# Altium schematic sheet Sheet1.SchDoc
size 762 x 381 mm
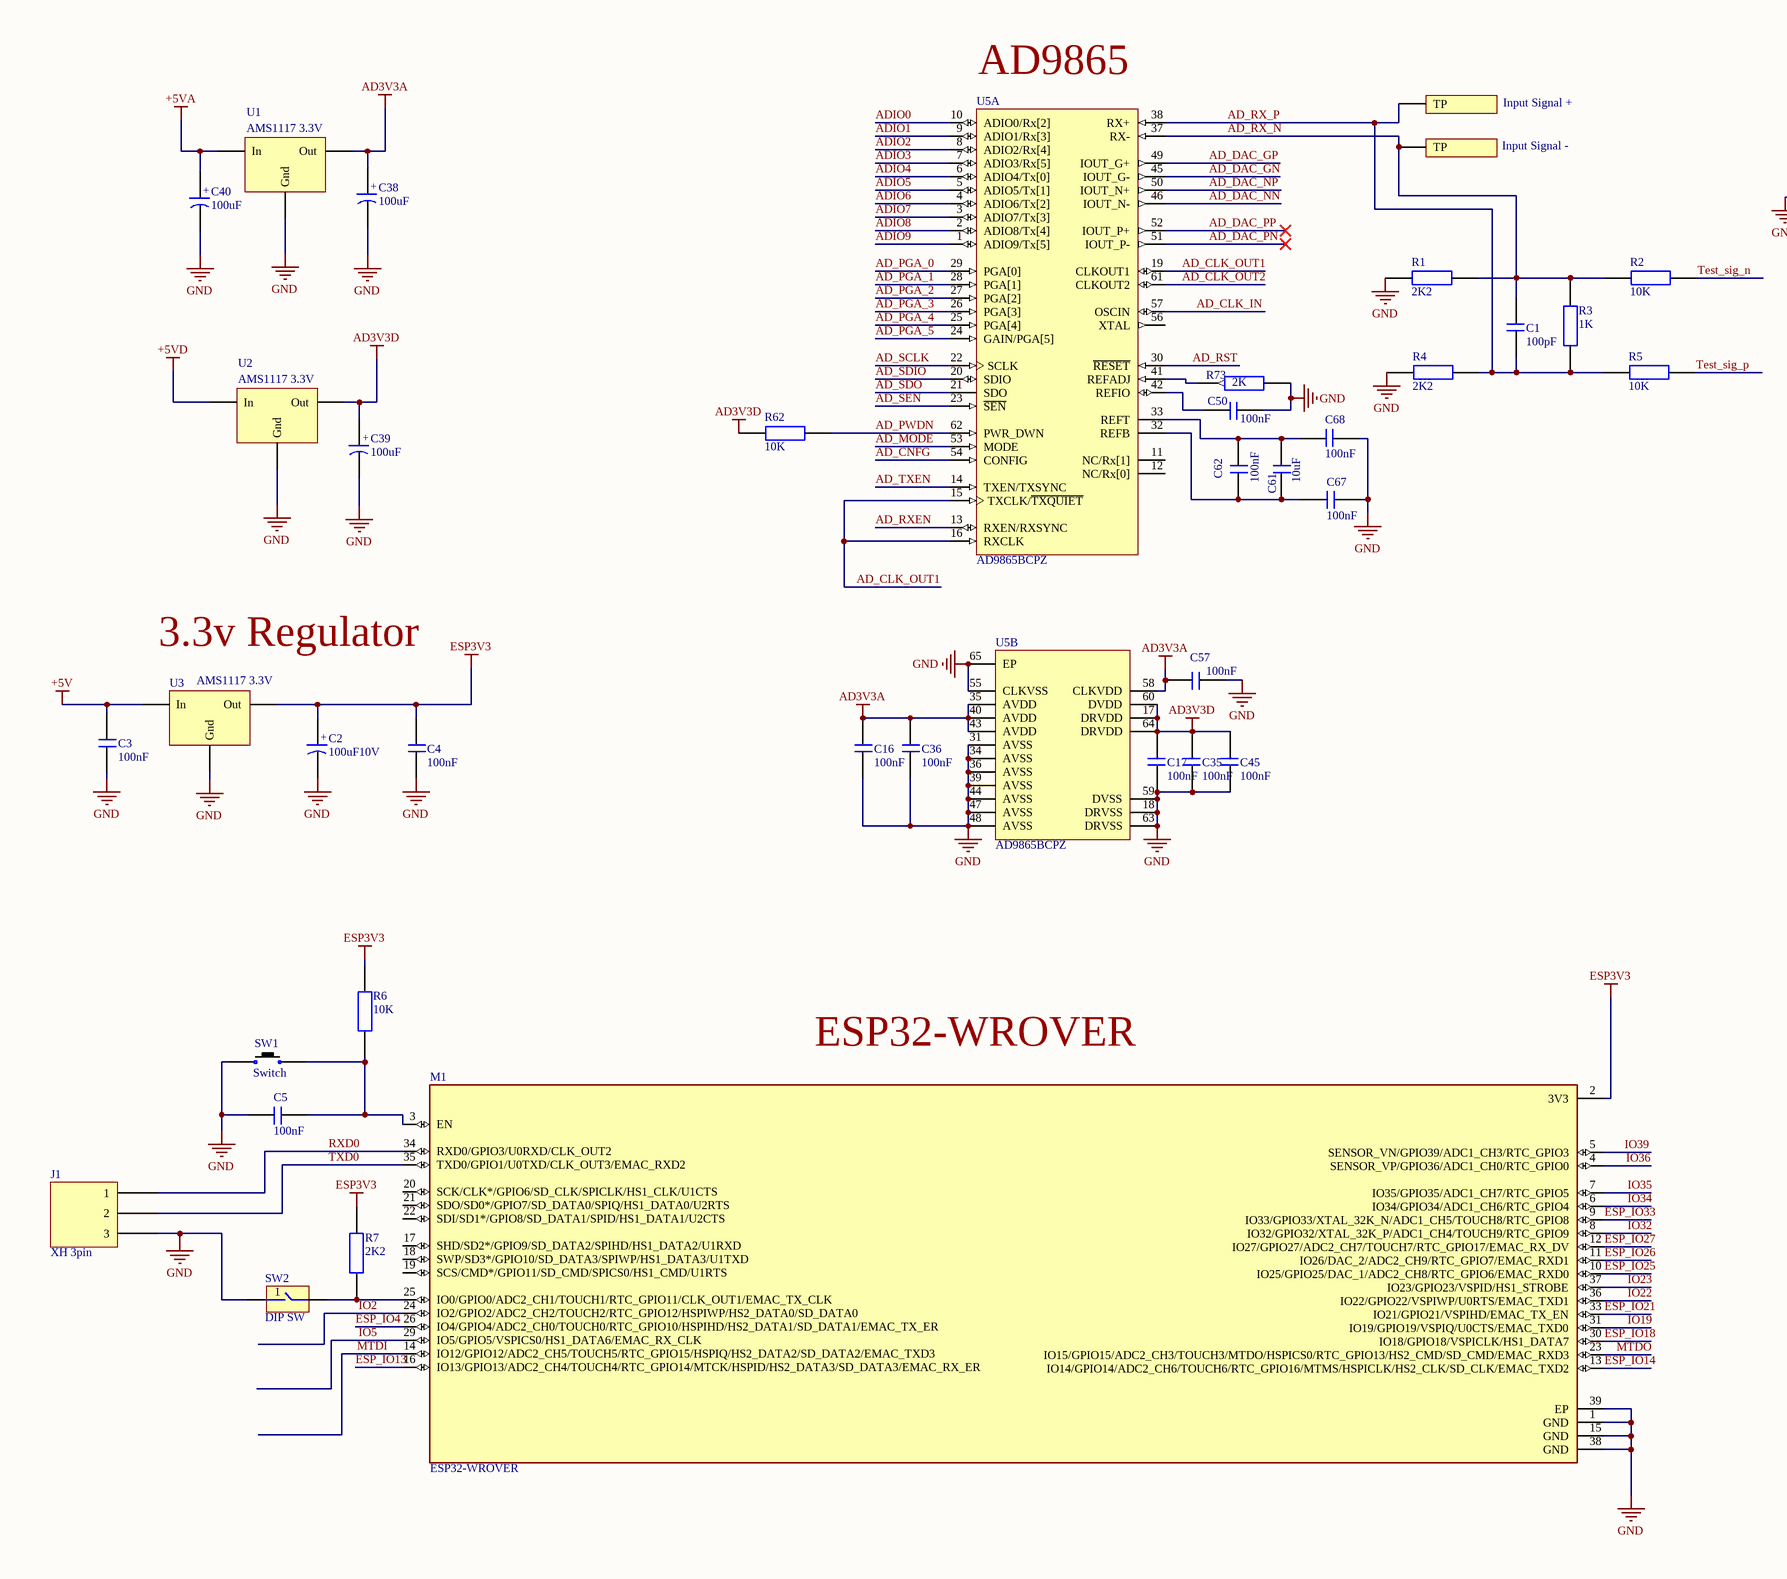
[diagram p0: Sheet1.SchDoc, left]
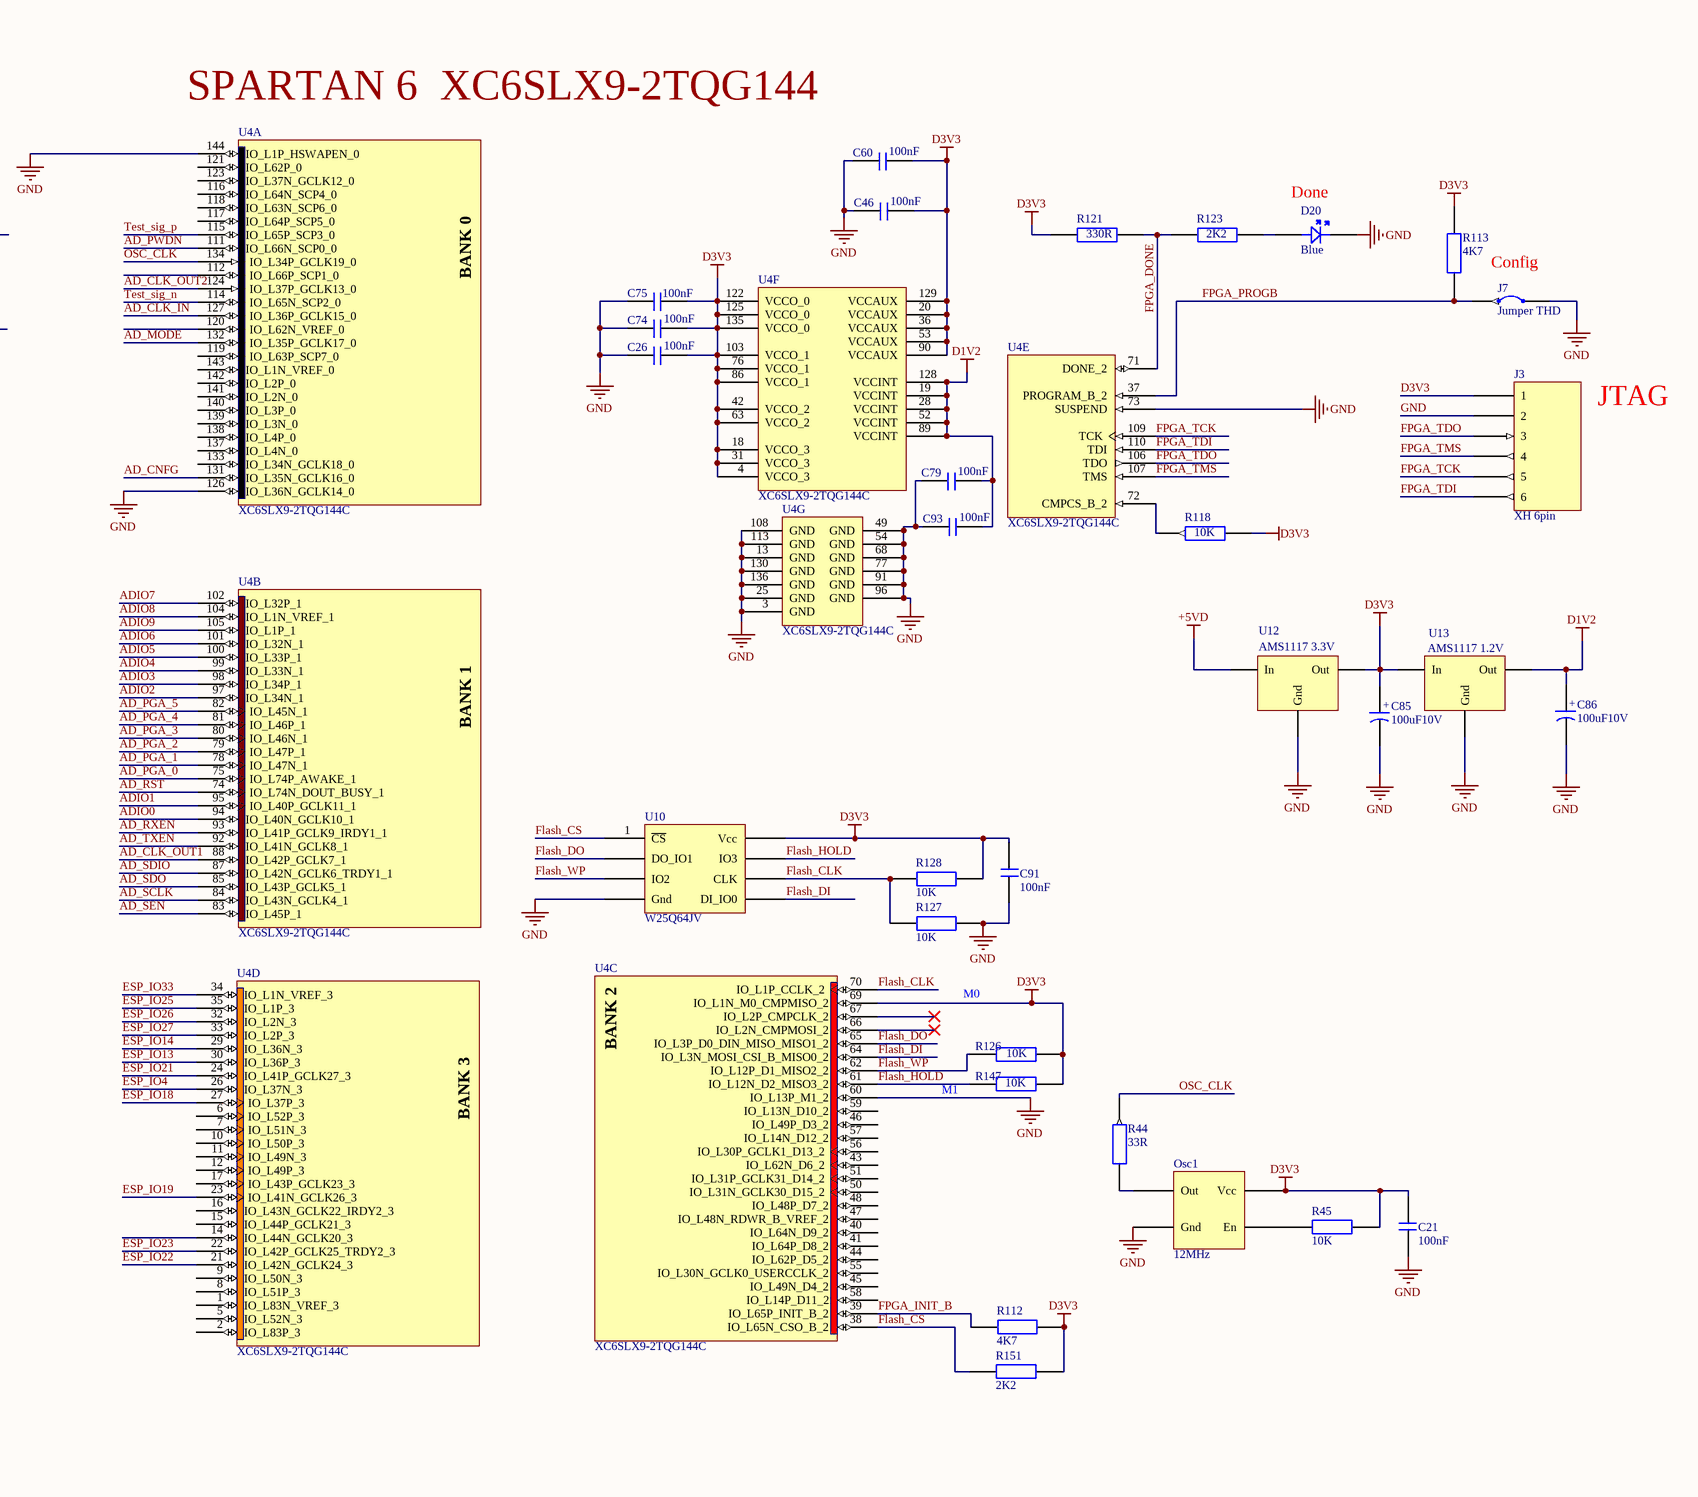
[diagram p1: Sheet1.SchDoc, right]

## Parts
C1  100pF  [CAP_0805]
C2  100uF10V  [Cap_Tan_Size_B]
C3  100nF  [CAP_0805]
C4  100nF  [CAP_0805]
C5  100nF  [CAP_0805]
C16  100nF  [CAP_0805]
C17  100nF  [CAP_0805]
C21  100nF  [CAP_0805]
C26  100nF  [CAP_0805]
C35  100nF  [CAP_0805]
C36  100nF  [CAP_0805]
C38  100uF  [Cap_Tan_Size_B]
C39  100uF  [Cap_Tan_Size_B]
C40  100uF  [Cap_Tan_Size_B]
C45  100nF  [CAP_0805]
C46  100nF  [CAP_0805]
C50  100nF  [CAP_0805]
C57  100nF  [CAP_0805]
C60  100nF  [CAP_0805]
C61  10uF  [CAP_0805]
C62  100nF  [CAP_0805]
C67  100nF  [CAP_0805]
C68  100nF  [CAP_0805]
C74  100nF  [CAP_0805]
C75  100nF  [CAP_0805]
C79  100nF  [CAP_0805]
C85  100uF10V  [Cap_Tan_Size_B]
C86  100uF10V  [Cap_Tan_Size_B]
C91  100nF  [CAP_0805]
C93  100nF  [CAP_0805]
D20  Blue  [LED_0805_Blue]
J1  XH 3pin  [XH-3pin]
J3  XH 6pin  [XH-6pin]
J7  Jumper THD  [Jumper_2pin]
M1  ESP32-WROVER  [ESP32-WROVER]
Osc1  12MHz  [Osc_SMD_5x7]
R1  2K2  [RES_0805]
R2  10K  [RES_0805]
R3  1K  [RES_0805]
R4  2K2  [RES_0805]
R5  10K  [RES_0805]
R6  10K  [RES_0805]
R7  2K2  [RES_0805]
R44  33R  [RES_0805]
R45  10K  [RES_0805]
R62  10K  [RES_0805]
R73  2K  [RES_0805]
R112  4K7  [RES_0805]
R113  4K7  [RES_0805]
R118  10K  [RES_0805]
R121  330R  [RES_0805]
R123  2K2  [RES_0805]
R126  10K  [RES_0805]
R127  10K  [RES_0805]
R128  10K  [RES_0805]
R147  10K  [RES_0805]
R151  2K2  [RES_0805]
SW1  Switch  [Tact_SW_SMD]
SW2  DIP SW  [DIP_SW_1key]
TP1  Input Signal +  [TP]  (no BOM)
TP2  Input Signal -  [TP]  (no BOM)
U1  AMS1117 3.3V  [AMS1117-SOT223]
U2  AMS1117 3.3V  [AMS1117-SOT223]
U3  AMS1117 3.3V  [AMS1117-SOT223]
U4  XC6SLX9-2TQG144C  [XILINX-TQG144_M]  (parts A,B,C,D,E,F,G of 7)
U5  AD9865BCPZ  [LFCSP_64Lead]  (parts A,B of 2)
U10  W25Q64JV  [W25Q64]
U12  AMS1117 3.3V  [AMS1117-SOT223]
U13  AMS1117 1.2V  [AMS1117-SOT223]

## Nets
+5V: C3.2 U3.1(In)
+5VA: C40.+ U1.1(In)
+5VD: U2.1(In) U12.1(In)
AD3V3A: C16.2 C36.2 C38.+ C57.1 U1.3(Out) U5.35(AVDD) U5.40(AVDD) U5.43(AVDD) U5.58(CLKVDD)
AD3V3D: C17.1 C35.1 C39.+ C45.1 R62.1 U2.3(Out) U5.17(DRVDD) U5.60(DVDD) U5.64(DRVDD)
D1V2: C79.2 C86.+ C93.2 U4.19(VCCINT) U4.28(VCCINT) U4.52(VCCINT) U4.89(VCCINT) U4.128(VCCINT) U13.3(Out)
D3V3: C21.1 C26.2 C46.2 C60.2 C74.2 C75.2 C85.+ C91.2 J3.1 Osc1.1(Vcc) R45.2 R112.2 R113.2 R118.2 R121.1 R126.2 R128.2 R147.2 R151.2 U4.4(VCCO_3) U4.18(VCCO_3) U4.20(VCCAUX) U4.31(VCCO_3) U4.36(VCCAUX) U4.42(VCCO_2) U4.53(VCCAUX) U4.63(VCCO_2) U4.69(IO_L1N_M0_CMPMISO_2) U4.76(VCCO_1) U4.86(VCCO_1) U4.90(VCCAUX) U4.103(VCCO_1) U4.122(VCCO_0) U4.125(VCCO_0) U4.129(VCCAUX) U4.135(VCCO_0) U10.8(Vcc) U12.3(Out) U13.1(In)
ESP3V3: C2.+ C4.2 M1.2(3V3) R6.2 R7.2 U3.3(Out)
GND: C2.- C3.1 C4.1 C5.1 C16.1 C17.2 C21.2 C26.1 C35.2 C36.1 C38.- C39.- C40.- C45.2 C46.1 C50.2 C57.2 C60.1 C67.2 C68.1 C74.1 C75.1 C79.1 C85.- C86.- C91.1 C93.1 D20.2 J1.3 J3.2 J7.1 M1.1(GND) M1.15(GND) M1.38(GND) M1.39(EP) Osc1.4(Gnd) R1.2 R4.2 R73.2 R127.1 SW1.2 SW2.1 U1.2(Gnd) U2.2(Gnd) U3.2(Gnd) U4.3(GND) U4.13(GND) U4.25(GND) U4.49(GND) U4.54(GND) U4.60(IO_L13P_M1_2) U4.68(GND) U4.73(SUSPEND) U4.77(GND) U4.91(GND) U4.96(GND) U4.108(GND) U4.113(GND) U4.126(IO_L36N_GCLK14_0) U4.130(GND) U4.136(GND) U4.144(IO_L1P_HSWAPEN_0) U5.18(DRVSS) U5.31(AVSS) U5.34(AVSS) U5.36(AVSS) U5.39(AVSS) U5.44(AVSS) U5.47(AVSS) U5.48(AVSS) U5.55(CLKVSS) U5.59(DVSS) U5.63(DRVSS) U5.65(EP) U10.4(Gnd) U12.2(Gnd) U13.2(Gnd)
AD_CLK_IN: U4.127(IO_L36P_GCLK15_0) U5.57(OSCIN)
AD_CLK_OUT1: U4.88(IO_L42P_GCLK7_1) U5.15(TXCLK/~{TXQUIET}) U5.16(RXCLK) U5.19(CLKOUT1)
AD_CLK_OUT2: U4.124(IO_L37P_GCLK13_0) U5.61(CLKOUT2)
AD_CNFG: U4.131(IO_L35N_GCLK16_0) U5.54(CONFIG)
AD_DAC_GN: U5.45(IOUT_G-)
AD_DAC_GP: U5.49(IOUT_G+)
AD_DAC_NN: U5.46(IOUT_N-)
AD_DAC_NP: U5.50(IOUT_N+)
AD_DAC_PN: U5.51(IOUT_P-)
AD_DAC_PP: U5.52(IOUT_P+)
AD_MODE: U4.132(IO_L35P_GCLK17_0) U5.53(MODE)
AD_PGA_0: U4.75(IO_L74P_AWAKE_1) U5.29(PGA[0])
AD_PGA_1: U4.78(IO_L47N_1) U5.28(PGA[1])
AD_PGA_2: U4.79(IO_L47P_1) U5.27(PGA[2])
AD_PGA_3: U4.80(IO_L46N_1) U5.26(PGA[3])
AD_PGA_4: U4.81(IO_L46P_1) U5.25(PGA[4])
AD_PGA_5: U4.82(IO_L45N_1) U5.24(GAIN/PGA[5])
AD_PWDN: R62.2 U4.111(IO_L66N_SCP0_0) U5.62(PWR_DWN)
AD_RST: U4.74(IO_L74N_DOUT_BUSY_1) U5.30(~{RESET})
AD_RX_N: C1.1 R1.1 R2.2 R3.1 TP2.1(TP) U5.37(RX-)
AD_RX_P: C1.2 R3.2 R4.1 R5.2 TP1.1(TP) U5.38(RX+)
AD_RXEN: U4.93(IO_L41P_GCLK9_IRDY1_1) U5.13(RXEN/RXSYNC)
AD_SCLK: U4.84(IO_L43N_GCLK4_1) U5.22(SCLK)
AD_SDIO: U4.87(IO_L42N_GCLK6_TRDY1_1) U5.20(SDIO)
AD_SDO: U4.85(IO_L43P_GCLK5_1) U5.21(SDO)
AD_SEN: U4.83(IO_L45P_1) U5.23(~{SEN})
AD_TXEN: U4.92(IO_L41N_GCLK8_1) U5.14(TXEN/TXSYNC)
ADIO0: U4.94(IO_L40N_GCLK10_1) U5.10(ADIO0/Rx[2])
ADIO1: U4.95(IO_L40P_GCLK11_1) U5.9(ADIO1/Rx[3])
ADIO2: U4.97(IO_L34N_1) U5.8(ADIO2/Rx[4])
ADIO3: U4.98(IO_L34P_1) U5.7(ADIO3/Rx[5])
ADIO4: U4.99(IO_L33N_1) U5.6(ADIO4/Tx[0])
ADIO5: U4.100(IO_L33P_1) U5.5(ADIO5/Tx[1])
ADIO6: U4.101(IO_L32N_1) U5.4(ADIO6/Tx[2])
ADIO7: U4.102(IO_L32P_1) U5.3(ADIO7/Tx[3])
ADIO8: U4.104(IO_L1N_VREF_1) U5.2(ADIO8/Tx[4])
ADIO9: U4.105(IO_L1P_1) U5.1(ADIO9/Tx[5])
ESP_IO4: M1.26(IO4/GPIO4/ADC2_CH0/TOUCH0/RTC_GPIO10/HSPIHD/HS2_DATA1/SD_DATA1/EMAC_TX_ER) U4.26(IO_L37N_3)
ESP_IO13: M1.16(IO13/GPIO13/ADC2_CH4/TOUCH4/RTC_GPIO14/MTCK/HSPID/HS2_DATA3/SD_DATA3/EMAC_RX_ER) U4.30(IO_L36P_3)
ESP_IO14: M1.13(IO14/GPIO14/ADC2_CH6/TOUCH6/RTC_GPIO16/MTMS/HSPICLK/HS2_CLK/SD_CLK/EMAC_TXD2) U4.29(IO_L36N_3)
ESP_IO18: M1.30(IO18/GPIO18/VSPICLK/HS1_DATA7) U4.27(IO_L37P_3)
ESP_IO19: U4.23(IO_L41N_GCLK26_3)
ESP_IO21: M1.33(IO21/GPIO21/VSPIHD/EMAC_TX_EN) U4.24(IO_L41P_GCLK27_3)
ESP_IO22: U4.21(IO_L42N_GCLK24_3)
ESP_IO23: U4.22(IO_L42P_GCLK25_TRDY2_3)
ESP_IO25: M1.10(IO25/GPIO25/DAC_1/ADC2_CH8/RTC_GPIO6/EMAC_RXD0) U4.35(IO_L1P_3)
ESP_IO26: M1.11(IO26/DAC_2/ADC2_CH9/RTC_GPIO7/EMAC_RXD1) U4.32(IO_L2N_3)
ESP_IO27: M1.12(IO27/GPIO27/ADC2_CH7/TOUCH7/RTC_GPIO17/EMAC_RX_DV) U4.33(IO_L2P_3)
ESP_IO33: M1.9(IO33/GPIO33/XTAL_32K_N/ADC1_CH5/TOUCH8/RTC_GPIO8) U4.34(IO_L1N_VREF_3)
Flash_CLK: R127.2 R128.1 U4.70(IO_L1P_CCLK_2) U10.6(CLK)
Flash_CS: R151.1 U4.38(IO_L65N_CSO_B_2) U10.1(~{CS})
Flash_DI: U4.64(IO_L3N_MOSI_CSI_B_MISO0_2) U10.5(DI_IO0)
Flash_DO: U4.65(IO_L3P_D0_DIN_MISO_MISO1_2) U10.2(DO_IO1)
Flash_HOLD: R147.1 U4.61(IO_L12N_D2_MISO3_2) U10.7(IO3)
Flash_WP: R126.1 U4.62(IO_L12P_D1_MISO2_2) U10.3(IO2)
FPGA_DONE: R121.2 R123.1 U4.71(DONE_2)
FPGA_INIT_B: R112.1 U4.39(IO_L65P_INIT_B_2)
FPGA_PROGB: J7.2 R113.1 U4.37(PROGRAM_B_2)
FPGA_TCK: J3.5 U4.109(TCK)
FPGA_TDI: J3.6 U4.110(TDI)
FPGA_TDO: J3.3 U4.106(TDO)
FPGA_TMS: J3.4 U4.107(TMS)
IO2: M1.24(IO2/GPIO2/ADC2_CH2/TOUCH2/RTC_GPIO12/HSPIWP/HS2_DATA0/SD_DATA0)
IO5: M1.29(IO5/GPIO5/VSPICS0/HS1_DATA6/EMAC_RX_CLK)
IO19: M1.31(IO19/GPIO19/VSPIQ/U0CTS/EMAC_TXD0)
IO22: M1.36(IO22/GPIO22/VSPIWP/U0RTS/EMAC_TXD1)
IO23: M1.37(IO23/GPIO23/VSPID/HS1_STROBE)
IO32: M1.8(IO32/GPIO32/XTAL_32K_P/ADC1_CH4/TOUCH9/RTC_GPIO9)
IO34: M1.6(IO34/GPIO34/ADC1_CH6/RTC_GPIO4)
IO35: M1.7(IO35/GPIO35/ADC1_CH7/RTC_GPIO5)
IO36: M1.4(SENSOR_VP/GPIO36/ADC1_CH0/RTC_GPIO0)
IO39: M1.5(SENSOR_VN/GPIO39/ADC1_CH3/RTC_GPIO3)
MTDI: M1.14(IO12/GPIO12/ADC2_CH5/TOUCH5/RTC_GPIO15/HSPIQ/HS2_DATA2/SD_DATA2/EMAC_TXD3)
MTDO: M1.23(IO15/GPIO15/ADC2_CH3/TOUCH3/MTDO/HSPICS0/RTC_GPIO13/HS2_CMD/SD_CMD/EMAC_RXD3)
OSC_CLK: R44.1 U4.134(IO_L34P_GCLK19_0)
RXD0: J1.1 M1.34(RXD0/GPIO3/U0RXD/CLK_OUT2)
Test_sig_n: R2.1 U4.114(IO_L65N_SCP2_0)
Test_sig_p: R5.1 U4.115(IO_L65P_SCP3_0)
TXD0: J1.2 M1.35(TXD0/GPIO1/U0TXD/CLK_OUT3/EMAC_RXD2)
NetC5_2: C5.2 M1.3(EN) R6.1 SW1.1
NetC50_1: C50.1 U5.42(REFIO)
NetC61_1: C61.1 C62.1 C67.1 U5.32(REFB)
NetC61_2: C61.2 C62.2 C68.2 U5.33(REFT)
NetD20_1: D20.1 R123.2
NetM1_25: M1.25(IO0/GPIO0/ADC2_CH1/TOUCH1/RTC_GPIO11/CLK_OUT1/EMAC_TX_CLK) R7.1 SW2.2
NetOsc1_2: Osc1.2(En) R45.1
NetOsc1_3: Osc1.3(Out) R44.2
NetR73_1: R73.1 U5.41(REFADJ)
NetR118_1: R118.1 U4.72(CMPCS_B_2)

Not connected (* = marked no-connect by the designer): M1 17(SHD/SD2*/GPIO9/SD_DATA2/SPIHD/HS1_DATA2/U1RXD) 18(SWP/SD3*/GPIO10/SD_DATA3/SPIWP/HS1_DATA3/U1TXD) 19(SCS/CMD*/GPIO11/SD_CMD/SPICS0/HS1_CMD/U1RTS) 20(SCK/CLK*/GPIO6/SD_CLK/SPICLK/HS1_CLK/U1CTS) 21(SDO/SD0*/GPIO7/SD_DATA0/SPIQ/HS1_DATA0/U2RTS) 22(SDI/SD1*/GPIO8/SD_DATA1/SPID/HS1_DATA1/U2CTS); U4 1(IO_L83N_VREF_3) 2(IO_L83P_3) 5(IO_L52N_3) 6(IO_L52P_3) 7(IO_L51N_3) 8(IO_L51P_3) 9(IO_L50N_3) 10(IO_L50P_3) 11(IO_L49N_3) 12(IO_L49P_3) 14(IO_L44N_GCLK20_3) 15(IO_L44P_GCLK21_3) 16(IO_L43N_GCLK22_IRDY2_3) 17(IO_L43P_GCLK23_3) 40(IO_L64N_D9_2) 41(IO_L64P_D8_2) 43(IO_L62N_D6_2) 44(IO_L62P_D5_2) 45(IO_L49N_D4_2) 46(IO_L49P_D3_2) 47(IO_L48N_RDWR_B_VREF_2) 48(IO_L48P_D7_2) 50(IO_L31N_GCLK30_D15_2) 51(IO_L31P_GCLK31_D14_2) 55(IO_L30N_GCLK0_USERCCLK_2) 56(IO_L30P_GCLK1_D13_2) 57(IO_L14N_D12_2) 58(IO_L14P_D11_2) 59(IO_L13N_D10_2) 66(IO_L2N_CMPMOSI_2)* 67(IO_L2P_CMPCLK_2)* 112(IO_L66P_SCP1_0) 116(IO_L64N_SCP4_0) 117(IO_L64P_SCP5_0) 118(IO_L63N_SCP6_0) 119(IO_L63P_SCP7_0) 120(IO_L62N_VREF_0) 121(IO_L62P_0) 123(IO_L37N_GCLK12_0) 133(IO_L34N_GCLK18_0) 137(IO_L4N_0) 138(IO_L4P_0) 139(IO_L3N_0) 140(IO_L3P_0) 141(IO_L2N_0) 142(IO_L2P_0) 143(IO_L1N_VREF_0); U5 11(NC/Rx[1]) 12(NC/Rx[0]) 56(XTAL)

## Notes on the sheet
- (near U5) AD9865
- (near U4) SPARTAN 6  XC6SLX9-2TQG144
- (near D20) Done
- Config
- JTAG
- (near U3) 3.3v Regulator
- (near M1) ESP32-WROVER
- M0
- M1
- (in symbol XC6SLX9-2TQG144C, part A) BANK 0
- (in symbol XC6SLX9-2TQG144C, part B) BANK 1
- (in symbol XC6SLX9-2TQG144C, part C) BANK 2
- (in symbol XC6SLX9-2TQG144C, part D) BANK 3

## Library data of the parts
C1 C3-C5 C16 C17 C21 C26 C35 C36 C45 C46 C50 C57 C60-C62 C67 C68 C74 C75 C79 C91 C93 = Cap0805: Capacitor SMD 0805
C2 C38-C40 C85 C86 = Cap_Tant_B: Capacitor SMD Tantalium Size B
D20 = LED_0805_Blue: LED SMD 0805 Blue
J1 = Con_XH_3pin: Connector XH Female 3-pin
J3 = Con_XH_6pin: Connector XH Female 6-pin
J7 = Jumper DIP: Jumper pin header + jumper 2pin pirch=2.54mm
M1 = ESP32-WROVER: Bluetooth, WiFi 802.11b/g/n, Bluetooth v4.2 + EDR, Class 1, 2 and 3 Transceiver Module 2.4GHz ~ 2.5GHz PCB Trace Surface Mount; pin to pad: 1>GND 2>VDD33 3>EN 4>SENSOR_VP 5>SENSOR_VN 6>IO34 7>IO35 8>IO32 9>IO33 10>IO25 11>IO26 12>IO27 13>IO14 14>IO12 15>GND 16>IO13 17>SD2 18>SD3 19>CMD 20>CLK 21>SD0 22>SD1 23>IO15 24>IO2 25>IO0 26>IO4 29>IO5 30>IO18 31>IO19 33>IO21 34>RXD0 35>TXD0 36>IO22 37>IO23 38>GND 39>GND; MF: Espressif Systems; Package: Module Espressif Systems; Price: None; SnapEDA_Link: https://www.snapeda.com/parts/ESP32-WROVER/Espressif%20Systems/view-part/2293722/?ref=snap; Availability: Unavailable; Value: *; MP: ESP32-WROVER
Osc1 = Osc_SMD: Oscillator SMD 5x7; pin to pad: 1>Vcc 2>EN 3>Out 4>Gnd
R1-R7 R44 R45 R62 R73 R112 R113 R118 R121 R123 R126-R128 R147 R151 = Res0805: Resistor SMD 0805
SW1 = Tact_sw: Tact switch SMD 2pin
SW2 = DIP_SW_1: DIP Swtich 1 key
TP1 TP2 = TP: Test point
U1-U3 U12 U13 = AMS1117-SOT223: AMS1117 Regulator 3.3V SMD SOT223; pin to pad: 1>In 2>Gnd_Adj 3>Out
U4 = XC6SLX9-2TQG144C: Spartan-6 LX 1.2V FPGA, 102 User I/Os, 144-Pin TQFP (0.5mm Pitch), Speed Grade 2, Commercial Grade, Pb-Free; DatasheetVersion: ver1.6, Nov-2010; PackageVersion: ver1.2, Jun-2004; PackageReference: TQG144; PackageDescription: 144-Pin Thin Quad Flat Pack (TQG144) - Pb-Free; Code_JEDEC: MS-026-BFB; ComponentLink1Description: Manufacturer URL; ComponentLink1URL: http://www.xilinx.com/; ComponentLink2Description: Spartan-6 Datasheet; ComponentLink2URL: http://www.xilinx.com/support/documentation/data_sheets/ds160.pdf; ComponentLink3Description: Spartan-6 Documents; ComponentLink3URL: http://www.xilinx.com/support/documentation/spartan-6.htm
U5 = AD9865BCPZ: Broadband Modem Mixed-Signal Front End, 80MSPS, -40 to +85 degC, CP-64-3, Pb-Free, Tray; Generic Part Number: AD9865; Manufacturer: Analog Devices; Resolution (Bits): 10; Channels: 1; Throughput Rate (SPS): 80M; Interface: Par; DatasheetVersion: Rev.A; PackageVersion: 051007-C; PackageReference: CP-64-3; PackageDescription: 64-Lead Lead Frame Chip Scale Package [LFCSP_VQ] 9 x 9 mm Body, Very Thin Quad; Supplier 1: Digi-Key; Supplier Part Number 1: AD9865BCPZ-ND; Supplier 2: Farnell; Supplier Part Number 2: 8398410; Supplier 3: Newark; Supplier Part Number 3: 59K7504; Supplier 4: Mouser; Supplier Part Number 4: 584-AD9865BCPZ; RoHS: Y; Packing: Tray; Mounting Technology: Surface Mount; Code_JEDEC: MO-220-VMMD-4; PartNumber: AD9865BCPZ; ComponentLink1Description: Manufacturer URL; ComponentLink1URL: http://www.analog.com/en/index.html; ComponentLink2Description: Datasheet; ComponentLink2URL: http://www.analog.com/static/imported-files/data_sheets/AD9865.pdf; ComponentLink3Description: Package Specification; ComponentLink3URL: http://www.analog.com/static/imported-files/packages/PKG_PDF/LFCSP(CP)/CP_64_3.pdf; ComponentLink4Description: Product URL; ComponentLink4URL: http://www.analog.com/en/analog-to-digital-converters/ad-converters/ad9865/products/product.html
U10 = W25Q64JV: Serial Flash Memory 64Mbit